# EAGLE design Lia_Sonic (EAGLE 6.4)
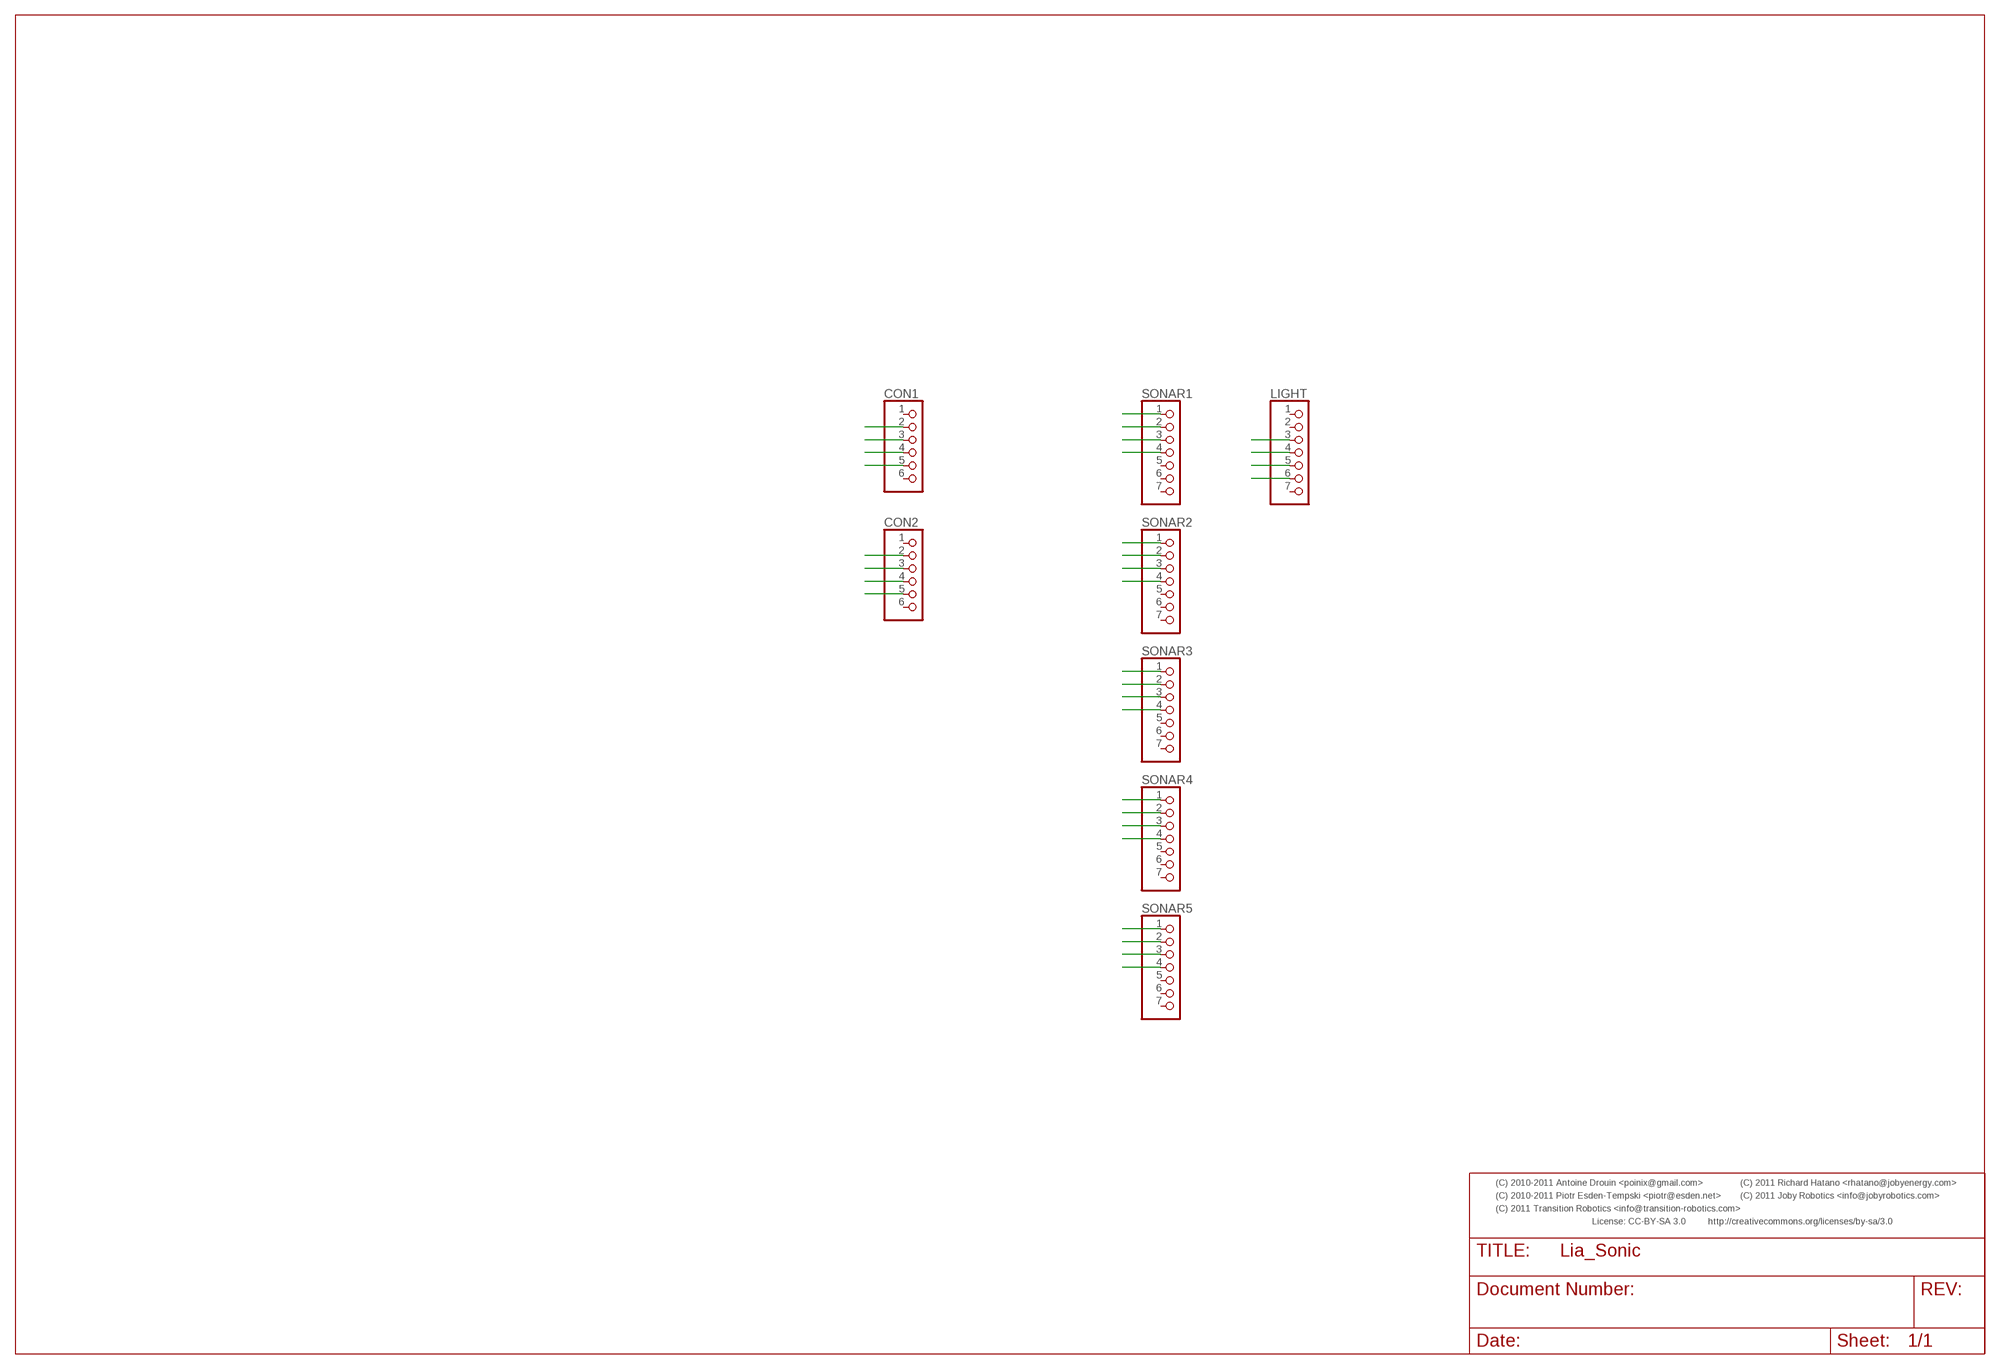
[diagram p0: schematic, sheet 1]

## Parts
CON1  PINHD-1X6  [1X06]
CON2  PINHD-1X6  [1X06]
LIGHT  PINHD-1X7  [1X07]
SONAR1  PINHD-1X7  [1X07]
SONAR2  PINHD-1X7  [1X07]
SONAR3  PINHD-1X7  [1X07]
SONAR4  PINHD-1X7  [1X07]
SONAR5  PINHD-1X7  [1X07]

## Nets
GND: CON1.2 CON2.5 LIGHT.6 SONAR1.1 SONAR2.1 SONAR3.1 SONAR4.1 SONAR5.1
SCL: CON1.4 CON2.3 LIGHT.4 SONAR1.3 SONAR2.3 SONAR3.3 SONAR4.3 SONAR5.3
SDA: CON1.5 CON2.2 LIGHT.3 SONAR1.4 SONAR2.4 SONAR3.4 SONAR4.4 SONAR5.4
VCC: CON1.3 CON2.4 LIGHT.5 SONAR1.2 SONAR2.2 SONAR3.2 SONAR4.2 SONAR5.2
Unconnected: CON1.1 CON1.6 CON2.1 CON2.6 LIGHT.1 LIGHT.2 LIGHT.7 SONAR1.5 SONAR1.6 SONAR1.7 SONAR2.5 SONAR2.6 SONAR2.7 SONAR3.5 SONAR3.6 SONAR3.7 SONAR4.5 SONAR4.6 SONAR4.7 SONAR5.5 SONAR5.6 SONAR5.7

## Notes on the sheet
- (C) 2010-2011 Antoine Drouin <poinix@gmail.com> | (C) 2011 Richard Hatano <rhatano@jobyenergy.com>
- (C) 2010-2011 Piotr Esden-Tempski <piotr@esden.net> | (C) 2011 Joby Robotics <info@jobyrobotics.com>
- (C) 2011 Transition Robotics <info@transition-robotics.com>
- License: CC-BY-SA 3.0 | http://creativecommons.org/licenses/by-sa/3.0

## Library data of the parts
CON1 CON2 = pinhead:PINHD-1X6: PIN HEADER
LIGHT SONAR1-SONAR5 = pinhead:PINHD-1X7: PIN HEADER

## Net classes
0 default: width 0.152 mm, drill 0.305 mm, clearance 0.152 mm

## Board
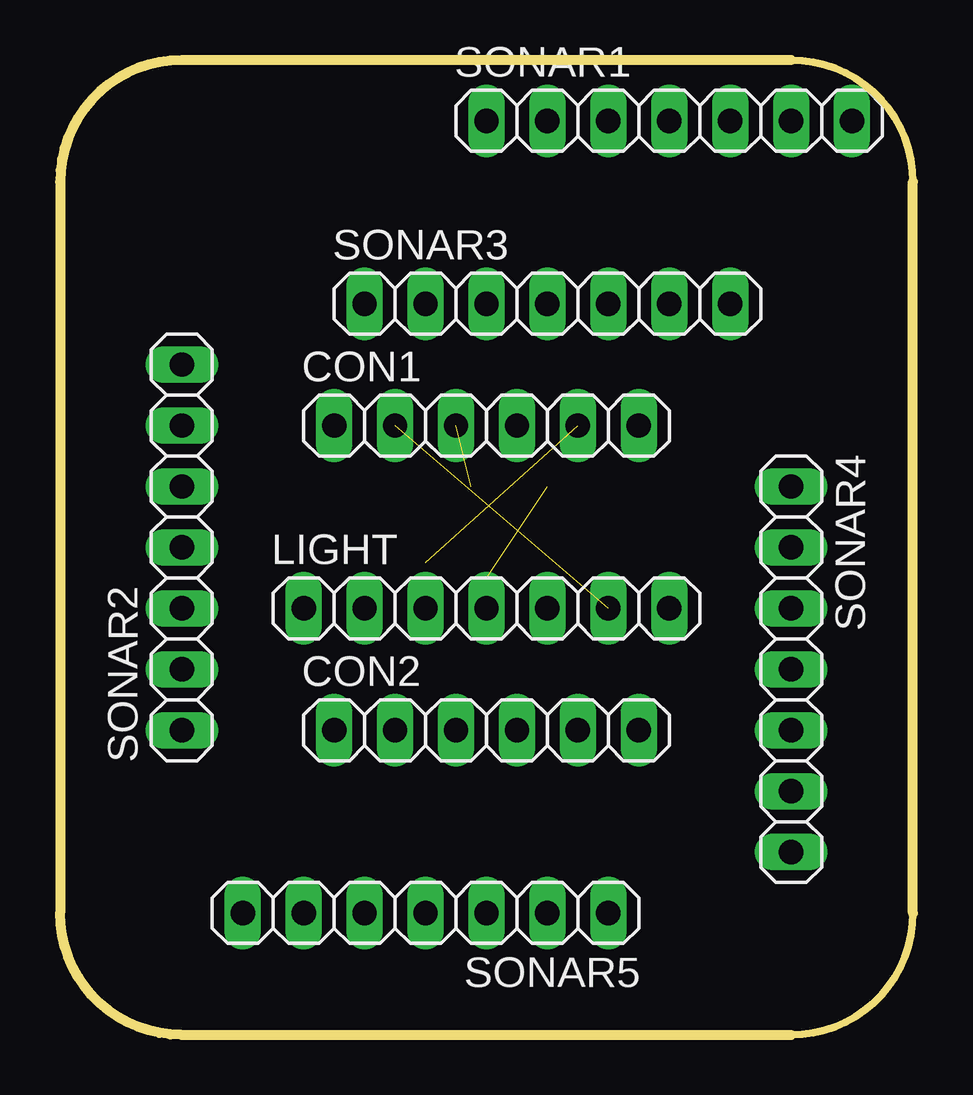
[diagram p1: board, top side]
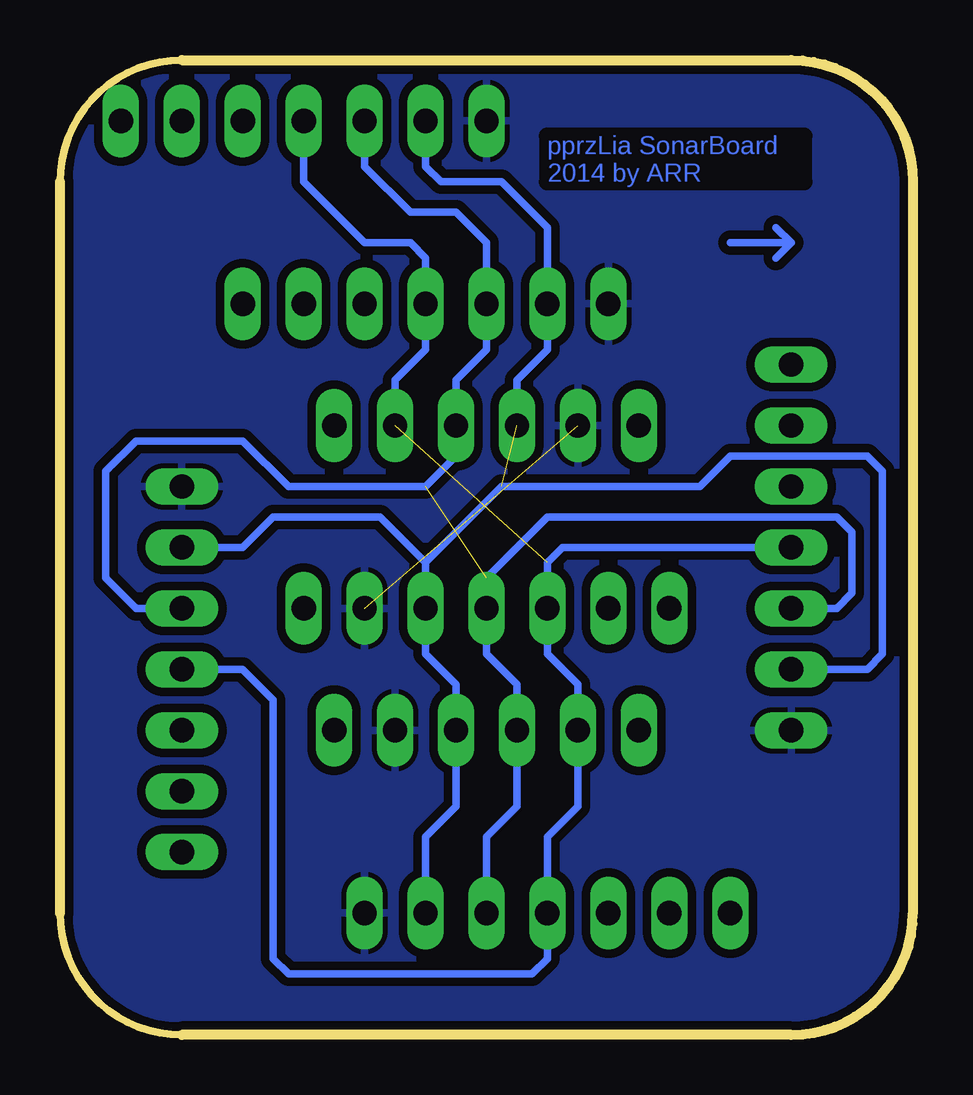
[diagram p2: board, bottom side, seen from below]

Size 35.56 x 40.64 mm. Coordinates in mm from the lower left corner, seen from the top.
Outline: 5.08,0 30.48,0 arc90 35.56,5.08 35.56,35.56 arc90 30.48,40.64 5.08,40.64 arc90 0,35.56 0,5.08 arc90 5.08,0
Copper layers (1*2+15*16): Top 0.035mm / dielectric 0.2mm / Route2 0.035mm / dielectric 1.5mm / Route15 0.035mm / dielectric 0.2mm / Bottom 0.035mm
Design rules "default *": minimum track width 0.15mm, minimum drill 10mil, track to track 8mil, track to pad 8mil, pad to pad 8mil, via to via 8mil, smd to smd 0.15mm, copper to edge 10mil, drill to drill 8mil, minimum pad ring 5mil, minimum via ring 5mil, stop-mask expansion 14mil, vias tented up to drill 0.31mm, thermal gap 8mil

### Footprints (pad centres in the part's own frame; a part is rotated, then mirrored left to right if it is on the bottom)
1X06 = drill 1.016 long: 1 -6.35,0; 2 -3.81,0; 3 -1.27,0; 4 1.27,0; 5 3.81,0; 6 6.35,0
1X07 = drill 1.016 long: 1 -7.62,0; 2 -5.08,0; 3 -2.54,0; 4 0,0; 5 2.54,0; 6 5.08,0; 7 7.62,0

### Placement (x,y rotation side)
CON1  17.78,25.4 0 top
CON2  17.78,12.7 0 top
LIGHT  17.78,17.78 0 top
SONAR1  25.4,38.1 0 top
SONAR2  5.08,20.32 90 top
SONAR3  20.32,30.48 0 top
SONAR4  30.48,15.24 270 top
SONAR5  15.24,5.08 180 top

### Tracks (layer width: path | path; a pad name or v marks a point on that pad's centre or on a via)
GND  (1 unrouted)
  pour Bottom (isolate 0.356): 0,0 35.56,0 35.56,40.64 0,40.64
N$1
  Bottom 0.305: 7.62,33.02 5.08,33.02 | 5.08,33.02 5.71,33.66 | 5.08,33.02 5.71,32.38
SCL  (1 unrouted)
  Bottom 0.305: SONAR5.3 17.78,8.25 16.51,9.53 CON2.3 16.51,14.61 17.78,15.88 LIGHT.4 17.78,19.05 15.24,21.59 3.18,21.59 2.54,20.95 2.54,18.41 3.18,17.78 SONAR2.3 | SONAR1.3 22.86,36.2 20.95,34.29 19.05,34.29 17.78,33.02 SONAR3.3 17.78,28.57 19.05,27.3 CON1.4 19.05,24.13 20.32,22.86 26.04,22.86 27.94,24.77 32.39,24.77 33.66,23.49 33.66,19.05 32.39,17.78 SONAR4.3
SDA  (1 unrouted)
  Bottom 0.305: SONAR4.4 27.94,15.24 26.67,13.97 26.67,3.17 26.04,2.54 15.88,2.54 15.24,3.17 SONAR5.4 15.24,8.25 13.97,9.53 CON2.2 13.97,14.61 15.24,15.88 LIGHT.3 15.24,19.68 14.61,20.32 SONAR2.4 | CON1.5 21.59,27.3 20.32,28.57 SONAR3.4 20.32,32.38 20.95,33.02 22.86,33.02 25.4,35.56 SONAR1.4
VCC  (1 unrouted)
  Bottom 0.305: SONAR5.2 20.32,8.25 19.05,9.53 CON2.4 19.05,14.61 20.32,15.88 LIGHT.5 20.32,19.68 | SONAR4.2 27.94,20.32 26.67,21.59 22.22,21.59 20.32,19.68 | SONAR2.2 1.9,15.24 1.27,15.88 1.27,23.49 1.9,24.13 7.62,24.13 8.89,22.86 17.14,22.86 20.32,19.68 | CON1.3 16.51,27.3 15.24,28.57 SONAR3.2 15.24,33.66 17.14,35.56 19.68,35.56 20.32,36.2 SONAR1.2

### Text on the board
Bottom: pprzLia SonarBoard / 2014 by ARR